# EAGLE schematic модель 1 — копия (EAGLE 9.4.2)
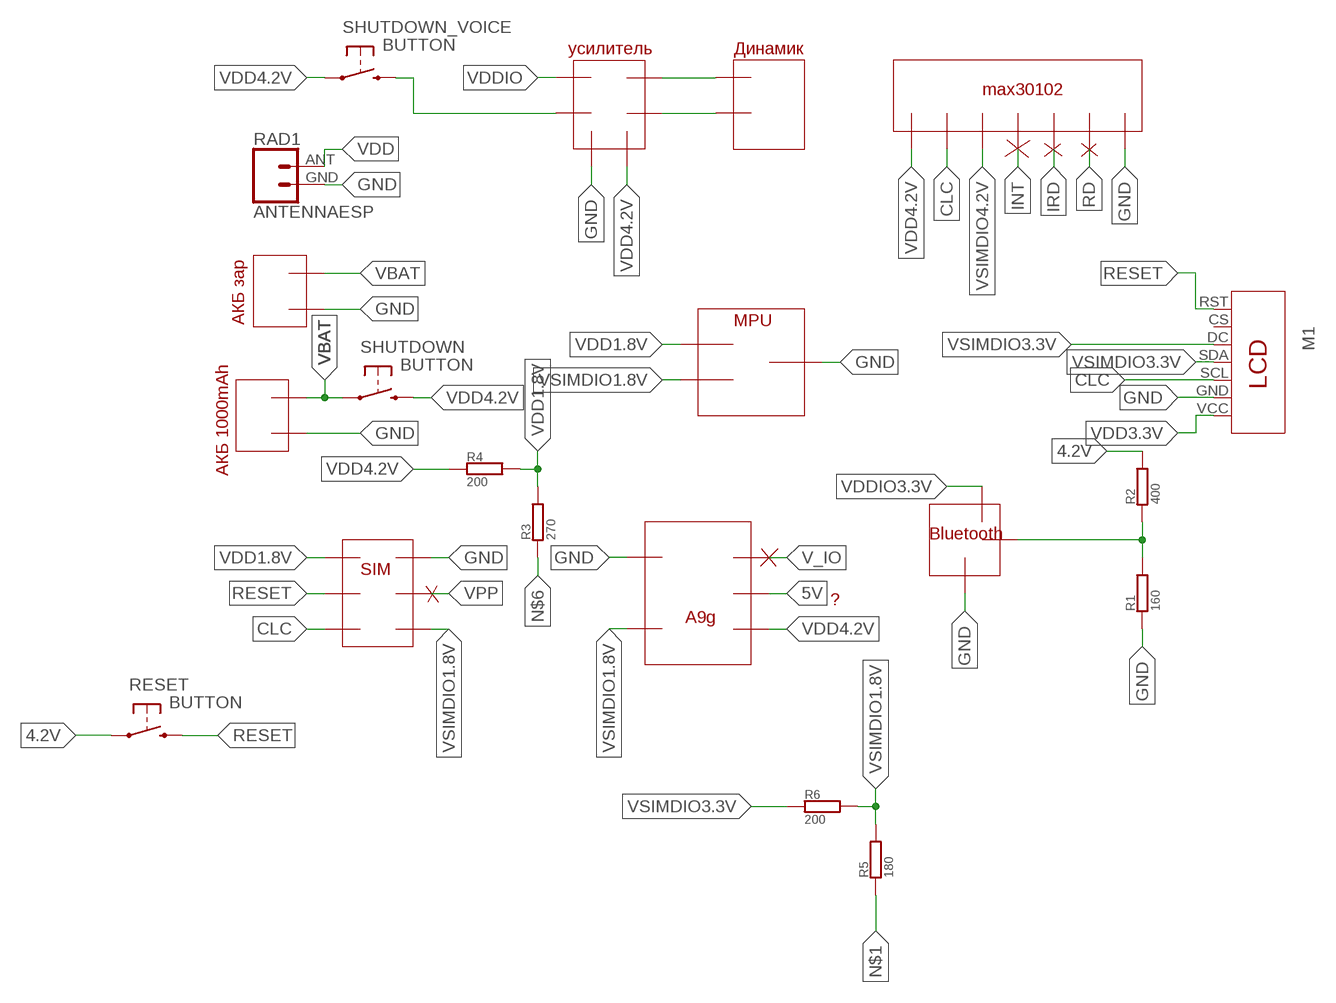
[diagram p0: schematic, sheet 1]

## Parts
M1  1.28TFT  [TFT1.28INCH]
R1  160  R0603  [0603]
R2  400  R0603  [0603]
R3  270  R0603  [0603]
R4  200  R0603  [0603]
R5  180  R0603  [0603]
R6  200  R0603  [0603]
RAD1  ANTENNAESP  [2.4GHZ]
RESET  BUTTON  [BUTTON]
SHUTDOWN  BUTTON  [BUTTON]
SHUTDOWN_VOICE  BUTTON  [BUTTON]

## Nets
3V: R1.P$2 R2.P$1
4.2V: R2.P$2 RESET.1
CLC: M1.SCL
GND: M1.GND R1.P$1 RAD1.GND
N$1: R5.P$1
N$6: R3.P$1
RESET: M1.RST RESET.2
SD: SHUTDOWN_VOICE.2
VBAT: SHUTDOWN.1
VDD: RAD1.ANT(ANTENNA)
VDD1.8V: R3.P$2 R4.P$2
VDD3.3V: M1.VCC
VDD4.2V: R4.P$1 SHUTDOWN.2 SHUTDOWN_VOICE.1
VSIMDIO1.8V: R5.P$2 R6.P$2
VSIMDIO3.3V: M1.DC M1.SDA R6.P$1
Unconnected: M1.CS

## Notes on the sheet
- усилитель | Динамик
- max30102
- АКБ зар | MPU
- АКБ 1000mAh
- Bluetooth
- SIM
- ?
- A9g

## Library data of the parts
M1 = LARS_409_MODULES:1.28TFT
R1-R6 = LARS_409_R,C,L:R
RAD1 = LARS_409_RADIO:ANTENNA
RESET SHUTDOWN SHUTDOWN_VOICE = LARS_409_SWITCH:BUTTON